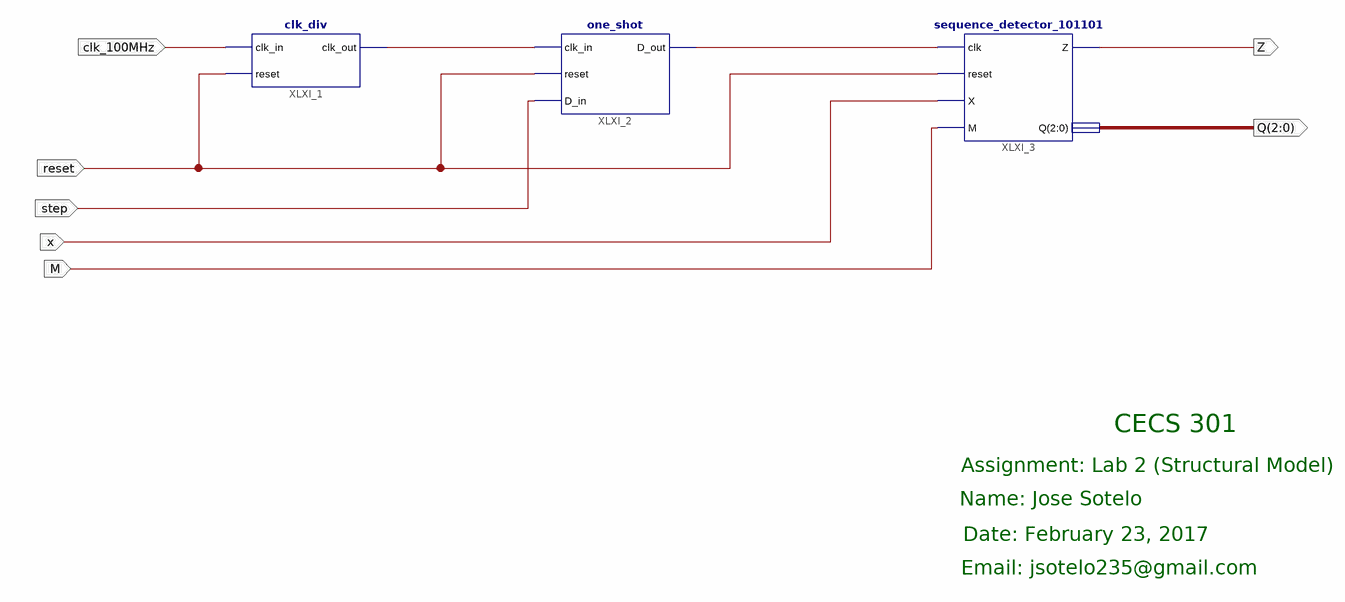
[diagram p0: schematic sheet 1]
// Xilinx ISE schematic moore_mealy_machine.sch (artix7) as structural Verilog: 3 symbols, 7 ports
module moore_mealy_machine (
  input  clk_100MHz,
  input  x,
  input  M,
  input  reset,
  input  step,
  output Z,
  output [2:0] Q
);

  wire XLXN_1, XLXN_2;

  clk_div XLXI_1 (.clk_in(clk_100MHz), .reset(reset), .clk_out(XLXN_1));
  one_shot XLXI_2 (.clk_in(XLXN_1), .reset(reset), .D_in(step), .D_out(XLXN_2));
  sequence_detector_101101 XLXI_3 (.clk(XLXN_2), .reset(reset), .X(x), .M(M), .Z(Z), .Q(Q));

  // Notes on the sheet:
  //   CECS 301
  //   Assignment: Lab 2 (Structural Model)
  //   Name: Jose Sotelo
  //   Date: February 23, 2017
  //   Email: jsotelo235@gmail.com
endmodule
